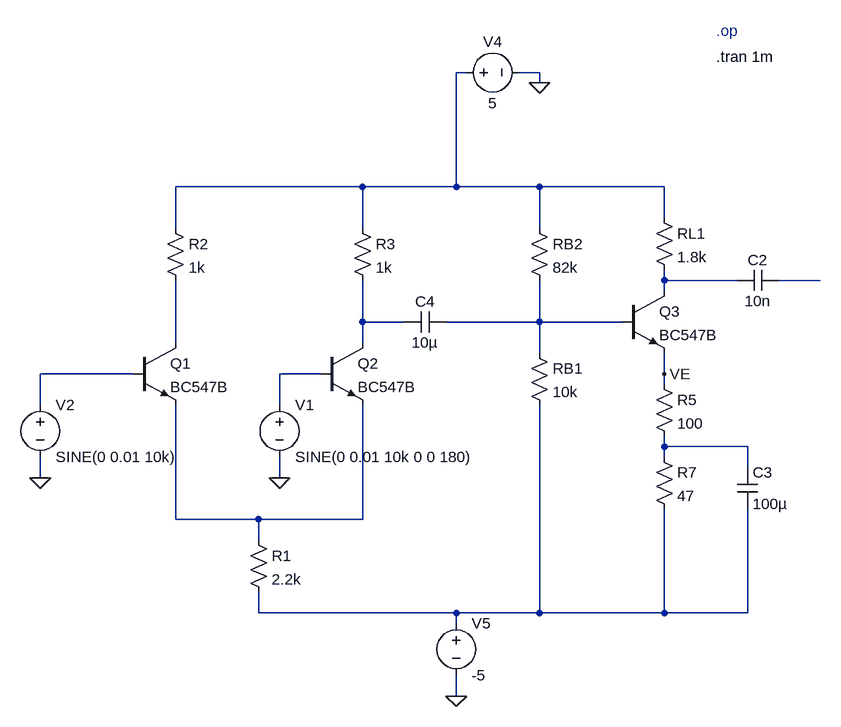
[diagram p0: schematic pre-amp+gain.asc]
pre-amp+gain.asc, the LTspice schematic file:
Version 4
SHEET 1 2080 872
WIRE 880 -112 864 -112
WIRE 992 -112 960 -112
WIRE 992 -96 992 -112
WIRE 720 64 432 64
WIRE 864 64 864 -112
WIRE 864 64 720 64
WIRE 992 64 864 64
WIRE 1184 64 992 64
WIRE 1184 112 1184 64
WIRE 432 128 432 64
WIRE 720 128 720 64
WIRE 992 128 992 64
WIRE 1184 208 1184 192
WIRE 1296 208 1184 208
WIRE 1424 208 1360 208
WIRE 1184 224 1184 208
WIRE 720 272 720 208
WIRE 784 272 720 272
WIRE 992 272 992 208
WIRE 992 272 848 272
WIRE 1120 272 992 272
WIRE 432 304 432 208
WIRE 720 304 720 272
WIRE 992 320 992 272
WIRE 368 352 224 352
WIRE 656 352 592 352
WIRE 1184 352 1184 320
WIRE 1184 368 1184 352
WIRE 224 400 224 352
WIRE 592 400 592 352
WIRE 1184 464 1184 448
WIRE 1312 464 1184 464
WIRE 1184 480 1184 464
WIRE 1312 496 1312 464
WIRE 224 512 224 480
WIRE 592 512 592 480
WIRE 432 576 432 400
WIRE 560 576 432 576
WIRE 720 576 720 400
WIRE 720 576 560 576
WIRE 560 608 560 576
WIRE 560 720 560 688
WIRE 864 720 560 720
WIRE 992 720 992 400
WIRE 992 720 864 720
WIRE 1184 720 1184 560
WIRE 1184 720 992 720
WIRE 1312 720 1312 560
WIRE 1312 720 1184 720
WIRE 864 736 864 720
WIRE 864 848 864 816
FLAG 992 -96 0
FLAG 864 848 0
FLAG 224 512 0
FLAG 1184 352 VE
FLAG 592 512 0
DATAFLAG 1184 208 ""
DATAFLAG 928 272 ""
SYMBOL res 976 304 R0
SYMATTR InstName RB1
SYMATTR Value 10k
SYMBOL res 976 112 R0
SYMATTR InstName RB2
SYMATTR Value 82k
SYMBOL npn 1120 224 R0
SYMATTR InstName Q3
SYMATTR Value BC547B
SYMBOL res 1168 96 R0
SYMATTR InstName RL1
SYMATTR Value 1.8k
SYMBOL cap 1360 192 R90
WINDOW 0 0 32 VBottom 2
WINDOW 3 32 32 VTop 2
SYMATTR InstName C2
SYMATTR Value 10n
SYMBOL voltage 864 -112 R270
WINDOW 0 32 56 VTop 2
WINDOW 3 -32 56 VBottom 2
WINDOW 123 0 0 Left 0
WINDOW 39 0 0 Left 0
SYMATTR InstName V4
SYMATTR Value 5
SYMBOL Res 1168 352 R0
SYMATTR InstName R5
SYMATTR Value 100
SYMBOL Res 1168 464 R0
SYMATTR InstName R7
SYMATTR Value 47
SYMBOL Cap 1296 496 R0
SYMATTR InstName C3
SYMATTR Value 100µ
SYMBOL Voltage 864 720 R0
SYMATTR InstName V5
SYMATTR Value -5
SYMBOL npn 368 304 R0
SYMATTR InstName Q1
SYMATTR Value BC547B
SYMBOL npn 656 304 R0
SYMATTR InstName Q2
SYMATTR Value BC547B
SYMBOL Res 544 592 R0
SYMATTR InstName R1
SYMATTR Value 2.2k
SYMBOL Voltage 224 384 R0
SYMATTR InstName V2
SYMATTR Value SINE(0 0.01 10k)
SYMBOL Res 416 112 R0
SYMATTR InstName R2
SYMATTR Value 1k
SYMBOL Res 704 112 R0
SYMATTR InstName R3
SYMATTR Value 1k
SYMBOL Cap 848 256 R90
WINDOW 0 0 32 VBottom 2
WINDOW 3 32 32 VTop 2
SYMATTR InstName C4
SYMATTR Value 10µ
SYMBOL Voltage 592 384 R0
SYMATTR InstName V1
SYMATTR Value SINE(0 0.01 10k 0 0 180)
TEXT 1264 -136 Left 2 !.tran 1m
TEXT 1264 -176 Left 2 ;.op

The netlist it stands for:
* pre-amp+gain.asc
RB1 N005 N011 10k
RB2 N001 N005 82k
Q3 N002 N005 VE 0 BC547B
RL1 N001 N002 1.8k
C2 N003 N002 10n
V4 N001 0 5
R5 VE N009 100
R7 N009 N011 47
C3 N009 N011 100µ
V5 N011 0 -5
Q1 N006 N007 N010 0 BC547B
Q2 N004 N008 N010 0 BC547B
R1 N010 N011 2.2k
V2 N007 0 SINE(0 0.01 10k)
R2 N001 N006 1k
R3 N001 N004 1k
C4 N005 N004 10µ
V1 N008 0 SINE(0 0.01 10k 0 0 180)
.model NPN NPN
.model PNP PNP
.lib standard.bjt
.tran 1m
* .op
.backanno
.end